# Altium schematic sheet MotionControllerV1.1_EtherCAT.SchDoc
size 889 x 508 mm
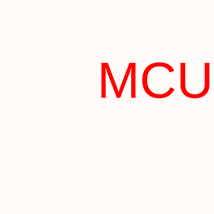
[diagram p0: MotionControllerV1.1_EtherCAT.SchDoc, top left]
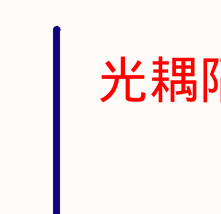
[diagram p1: MotionControllerV1.1_EtherCAT.SchDoc, top right]
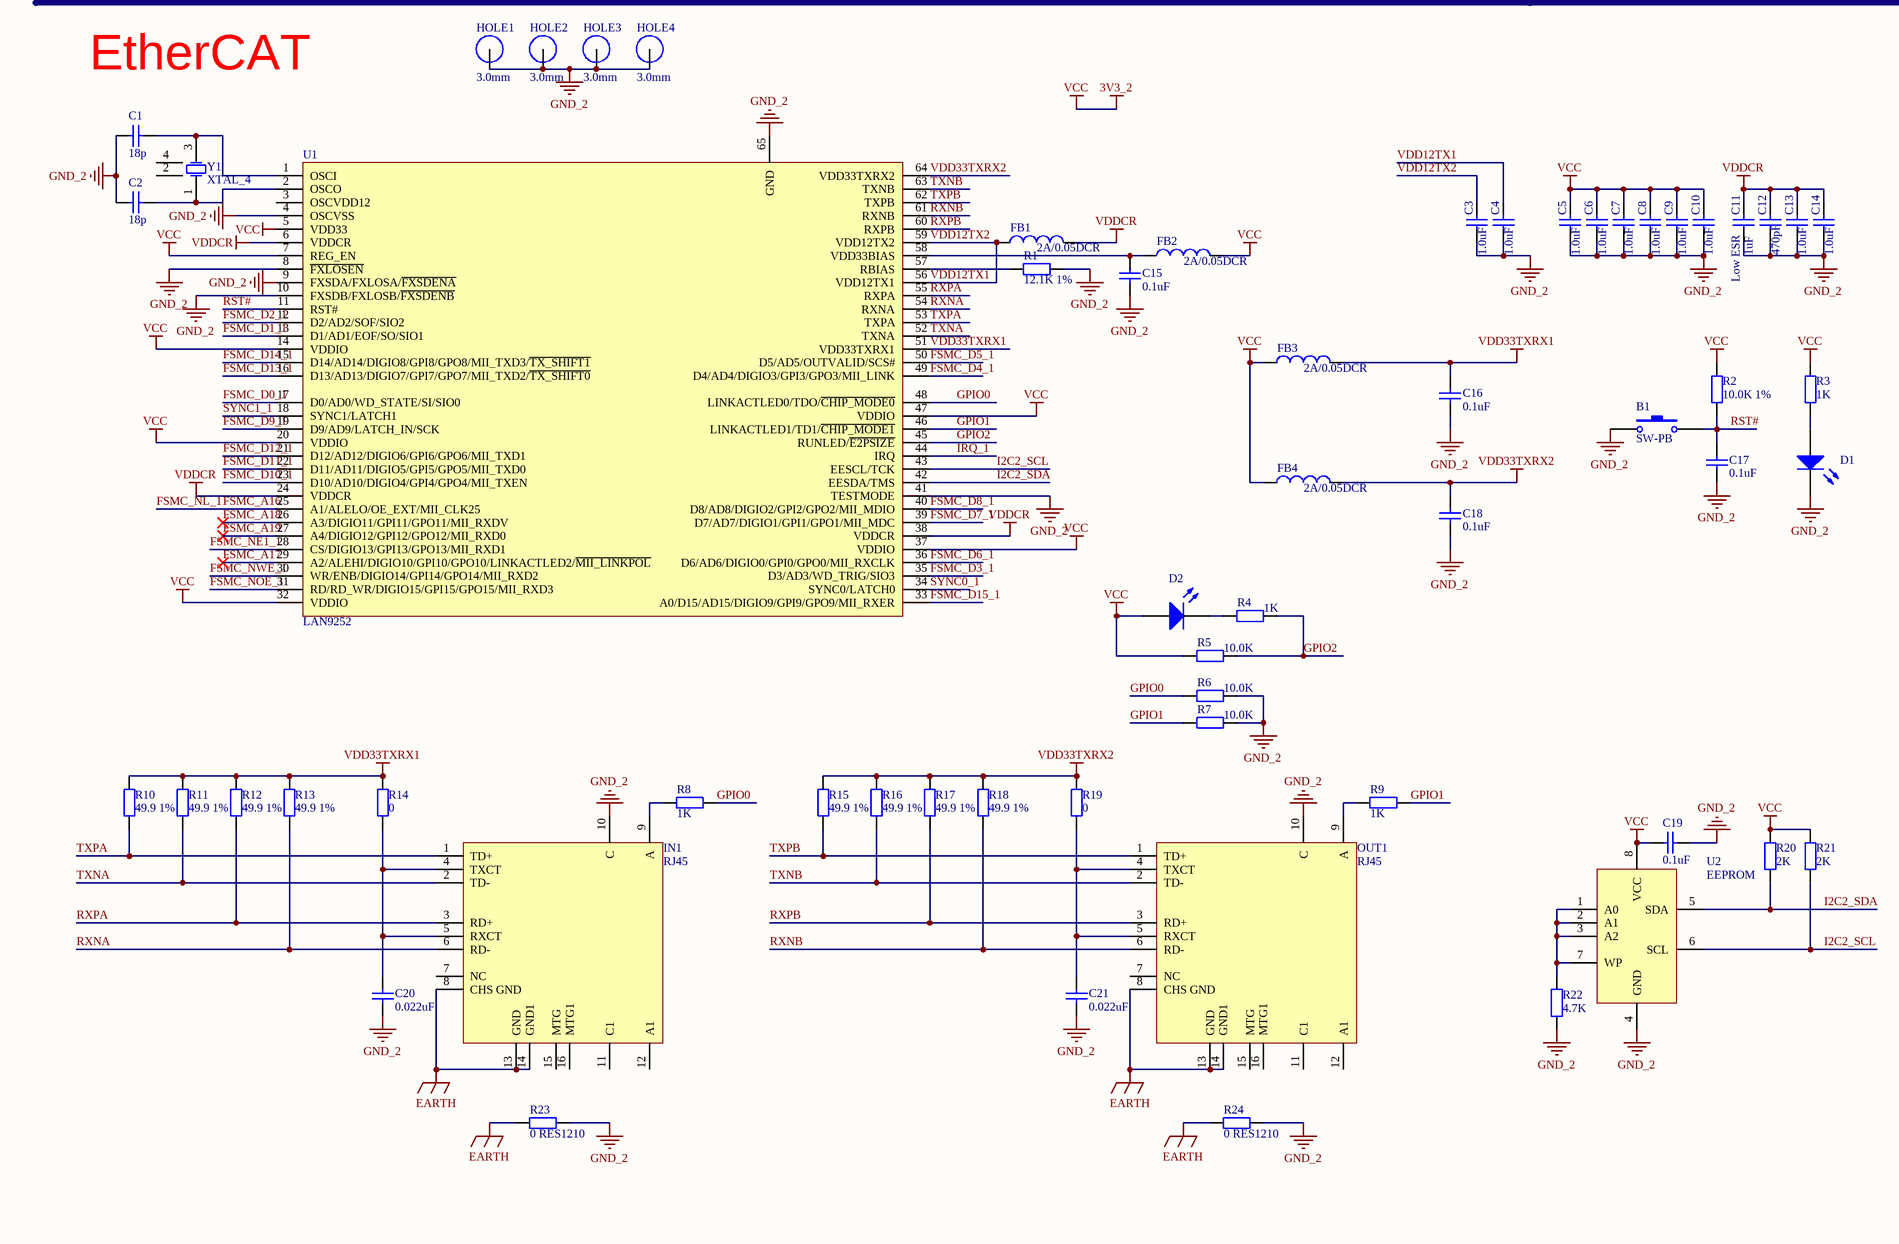
[diagram p2: MotionControllerV1.1_EtherCAT.SchDoc, bottom left]
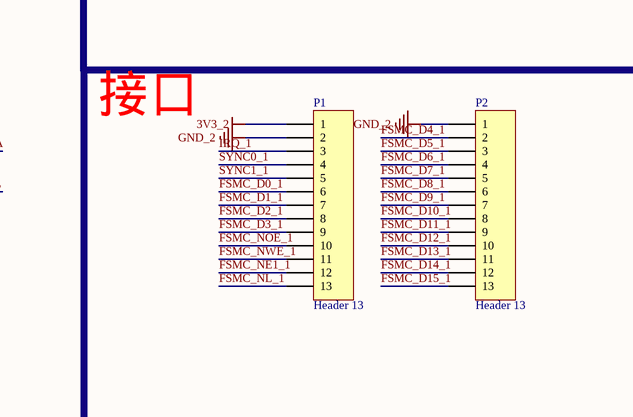
[diagram p3: MotionControllerV1.1_EtherCAT.SchDoc, bottom middle]
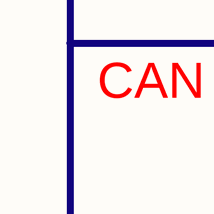
[diagram p4: MotionControllerV1.1_EtherCAT.SchDoc, bottom right]

## Parts
B1  SW-PB  [TSW SMD-3*6*2.5]
C1  value 18p  [0603_C]  (hidden comment: Cap)
C2  value 18p  [0603_C]  (hidden comment: Cap)
C3  value 1.0uF  [0603_C]  (hidden comment: Cap)
C4  value 1.0uF  [0603_C]  (hidden comment: Cap)
C5  value 1.0uF  [0603_C]  (hidden comment: Cap)
C6  value 1.0uF  [0603_C]  (hidden comment: Cap)
C7  value 1.0uF  [0603_C]  (hidden comment: Cap)
C8  value 1.0uF  [0603_C]  (hidden comment: Cap)
C9  value 1.0uF  [0603_C]  (hidden comment: Cap)
C10  value 1.0uF  [0603_C]  (hidden comment: Cap)
C11  value 1uF  [0603_C]  (hidden comment: Cap)
C12  value 470pF  [0603_C]  (hidden comment: Cap)
C13  value 1.0uF  [0603_C]  (hidden comment: Cap)
C14  value 1.0uF  [0603_C]  (hidden comment: Cap)
C15  value 0.1uF  [0603_C]  (hidden comment: Cap)
C16  value 0.1uF  [0603_C]  (hidden comment: Cap)
C17  value 0.1uF  [0603_C]  (hidden comment: Cap)
C18  value 0.1uF  [0603_C]  (hidden comment: Cap)
C19  value 0.1uF  [0603_C]  (hidden comment: Cap)
C20  value 0.022uF  [0603_C]  (hidden comment: Cap)
C21  value 0.022uF  [0603_C]  (hidden comment: Cap)
D1  LED0  [0603_LED]  (value not drawn)
D2  LED0  [0603_LED]  (value not drawn)
FB1  value 2A/0.05DCR  [FU 0805]  (hidden comment: Inductor)
FB2  value 2A/0.05DCR  [FU 0805]  (hidden comment: Inductor)
FB3  value 2A/0.05DCR  [FU 0805]  (hidden comment: Inductor)
FB4  value 2A/0.05DCR  [FU 0805]  (hidden comment: Inductor)
HOLE1  value 3.0mm  [M2.5x6+6_L]  (hidden comment: HOLE)
HOLE2  value 3.0mm  [M2.5x6+6_L]  (hidden comment: HOLE)
HOLE3  value 3.0mm  [M2.5x6+6_L]  (hidden comment: HOLE)
HOLE4  value 3.0mm  [M2.5x6+6_L]  (hidden comment: HOLE)
IN1  RJ45  [RJ-45A12]
OUT1  RJ45  [RJ-45A12]
P1  Header 13  [HDR2.54-LI-13P]
P2  Header 13  [HDR2.54-LI-13P]
R1  value 12.1K 1%  [0603_R]  (hidden comment: Res2)
R2  value 10.0K 1%  [0603_R]  (hidden comment: Res2)
R3  value 1K  [0603_R]  (hidden comment: Res2)
R4  value 1K  [0603_R]  (hidden comment: Res2)
R5  value 10.0K  [0603_R]  (hidden comment: Res2)
R6  value 10.0K  [0603_R]  (hidden comment: Res2)
R7  value 10.0K  [0603_R]  (hidden comment: Res2)
R8  value 1K  [0603_R]  (hidden comment: Res2)
R9  value 1K  [0603_R]  (hidden comment: Res2)
R10  value 49.9 1%  [0603_R]  (hidden comment: Res2)
R11  value 49.9 1%  [0603_R]  (hidden comment: Res2)
R12  value 49.9 1%  [0603_R]  (hidden comment: Res2)
R13  value 49.9 1%  [0603_R]  (hidden comment: Res2)
R14  value 0  [0603_R]  (hidden comment: Res2)
R15  value 49.9 1%  [0603_R]  (hidden comment: Res2)
R16  value 49.9 1%  [0603_R]  (hidden comment: Res2)
R17  value 49.9 1%  [0603_R]  (hidden comment: Res2)
R18  value 49.9 1%  [0603_R]  (hidden comment: Res2)
R19  value 0  [0603_R]  (hidden comment: Res2)
R20  value 2K  [0603_R]  (hidden comment: Res2)
R21  value 2K  [0603_R]  (hidden comment: Res2)
R22  value 4.7K  [0603_R]  (hidden comment: Res2)
R23  value 0 RES1210  [0603_R]  (hidden comment: Res2)
R24  value 0 RES1210  [0603_R]  (hidden comment: Res2)
U1  LAN9252  [QFN64]
U2  EEPROM  [SOP8]
Y1  XTAL_4  [OSC 3225-4P]

## Nets
3V3_2: C5.2 C6.2 C7.2 C8.2 C9.2 C10.2 C19.1 D2.1(A) FB2.2 FB3.1 FB4.1 P1.1 R2.1 R3.1 R5.2 R20.1 R21.1 U1.5(VDD33) U1.7(REG_EN) U1.14(VDDIO) U1.20(VDDIO) U1.32(VDDIO) U1.37(VDDIO) U1.47(VDDIO) U2.8(VCC)  [also labelled VCC]
EARTH: IN1.8(CHS_GND) IN1.13(GND) IN1.14(GND1) OUT1.8(CHS_GND) OUT1.13(GND) OUT1.14(GND1) R23.2 R24.2
GND_2: B1.1 C1.2 C2.2 C3.1 C4.1 C5.1 C6.1 C7.1 C8.1 C9.1 C10.1 C11.1 C12.1 C13.1 C14.1 C15.2 C16.2 C17.2 C18.2 C19.2 C20.2 C21.2 D1.2(K) HOLE1.1 HOLE2.1 HOLE3.1 HOLE4.1 IN1.10(C) OUT1.10(C) P1.2 P2.1 R1.1 R6.1 R7.1 R22.2 R23.1 R24.1 U1.4(OSCVSS) U1.8(~{FXLOSEN}) U1.9(FXSDA/FXLOSA/~{FXSDENA}) U1.10(FXSDB/FXLOSB/~{FXSDENB}) U1.41(TESTMODE) U1.65(GND) U2.4(GND)
VDD33TXRX1: C16.1 FB3.2 R10.2 R11.2 R12.2 R13.2 R14.2 U1.51(VDD33TXRX1)
VDD33TXRX2: C18.1 FB4.2 R15.2 R16.2 R17.2 R18.2 R19.2 U1.64(VDD33TXRX2)
VDDCR: C11.2 C12.2 C13.2 C14.2 FB1.2 U1.6(VDDCR) U1.24(VDDCR) U1.38(VDDCR)
FSMC_A16: P1.13 U1.25(A1/ALELO/OE_EXT/MII_CLK25)  [also labelled FSMC_NL_1]
FSMC_A17: U1.29(A2/ALEHI/DIGIO10/GPI10/GPO10/LINKACTLED2/~{MII_LINKPOL})
FSMC_A18: U1.26(A3/DIGIO11/GPI11/GPO11/MII_RXDV)
FSMC_A19: U1.27(A4/DIGIO12/GPI12/GPO12/MII_RXD0)
FSMC_D0_1: P1.6 U1.17(D0/AD0/WD_STATE/SI/SIO0)
FSMC_D1_1: P1.7 U1.13(D1/AD1/EOF/SO/SIO1)
FSMC_D2_1: P1.8 U1.12(D2/AD2/SOF/SIO2)
FSMC_D3_1: P1.9 U1.35(D3/AD3/WD_TRIG/SIO3)
FSMC_D4_1: P2.2 U1.49(D4/AD4/DIGIO3/GPI3/GPO3/MII_LINK)
FSMC_D5_1: P2.3 U1.50(D5/AD5/OUTVALID/SCS#)
FSMC_D6_1: P2.4 U1.36(D6/AD6/DIGIO0/GPI0/GPO0/MII_RXCLK)
FSMC_D7_1: P2.5 U1.39(D7/AD7/DIGIO1/GPI1/GPO1/MII_MDC)
FSMC_D8_1: P2.6 U1.40(D8/AD8/DIGIO2/GPI2/GPO2/MII_MDIO)
FSMC_D9_1: P2.7 U1.19(D9/AD9/LATCH_IN/SCK)
FSMC_D10_1: P2.8 U1.23(D10/AD10/DIGIO4/GPI4/GPO4/MII_TXEN)
FSMC_D11_1: P2.9 U1.22(D11/AD11/DIGIO5/GPI5/GPO5/MII_TXD0)
FSMC_D12_1: P2.10 U1.21(D12/AD12/DIGIO6/GPI6/GPO6/MII_TXD1)
FSMC_D13_1: P2.11 U1.16(D13/AD13/DIGIO7/GPI7/GPO7/MII_TXD2/~{TX_SHIFT0})
FSMC_D14_1: P2.12 U1.15(D14/AD14/DIGIO8/GPI8/GPO8/MII_TXD3/~{TX_SHIFT1})
FSMC_D15_1: P2.13 U1.33(A0/D15/AD15/DIGIO9/GPI9/GPO9/MII_RXER)
FSMC_NE1_1: P1.12 U1.28(CS/DIGIO13/GPI13/GPO13/MII_RXD1)
FSMC_NOE_1: P1.10 U1.31(RD/RD_WR/DIGIO15/GPI15/GPO15/MII_RXD3)
FSMC_NWE_1: P1.11 U1.30(WR/ENB/DIGIO14/GPI14/GPO14/MII_RXD2)
GPIO0: R6.2 R8.1 U1.48(LINKACTLED0/TDO/~{CHIP_MODE0})
GPIO1: R7.2 R9.1 U1.46(LINKACTLED1/TD1/~{CHIP_MODE1})
GPIO2: R4.1 R5.1 U1.45(RUNLED/~{E2PSIZE})
I2C2_SCL: R21.2 U1.43(EESCL/TCK) U2.6(SCL)
I2C2_SDA: R20.2 U1.42(EESDA/TMS) U2.5(SDA)
IRQ_1: P1.3 U1.44(IRQ)
RST#: B1.2 C17.1 R2.2 U1.11(RST#)
RXNA: IN1.6(RD-) R13.1 U1.54(RXNA)
RXNB: OUT1.6(RD-) R18.1 U1.61(RXNB)
RXPA: IN1.3(RD+) R12.1 U1.55(RXPA)
RXPB: OUT1.3(RD+) R17.1 U1.60(RXPB)
SYNC0_1: P1.4 U1.34(SYNC0/LATCH0)
SYNC1_1: P1.5 U1.18(SYNC1/LATCH1)
TXNA: IN1.2(TD-) R11.1 U1.52(TXNA)
TXNB: OUT1.2(TD-) R16.1 U1.63(TXNB)
TXPA: IN1.1(TD+) R10.1 U1.53(TXPA)
TXPB: OUT1.1(TD+) R15.1 U1.62(TXPB)
VDD12TX1: C3.2 C4.2 FB1.1 U1.56(VDD12TX1) U1.59(VDD12TX2)  [also labelled VDD12TX2]
NetC1_1: C1.1 U1.1(OSCI) Y1.3(OSC2)
NetC2_1: C2.1 U1.2(OSCO) Y1.1(OSC1)
NetC15_1: C15.1 FB2.1 U1.58(VDD33BIAS)
NetC20_1: C20.1 IN1.4(TXCT) IN1.5(RXCT) R14.1
NetC21_1: C21.1 OUT1.4(TXCT) OUT1.5(RXCT) R19.1
NetD1_1: D1.1(A) R3.2
NetD2_2: D2.2(K) R4.2
NetIN1_9: IN1.9(A) R8.2
NetOUT1_9: OUT1.9(A) R9.2
NetR1_2: R1.2 U1.57(RBIAS)
NetR22_1: R22.1 U2.1(A0) U2.2(A1) U2.3(A2) U2.7(WP)

Not connected (* = marked no-connect by the designer): IN1 7(NC) 11(C1) 12(A1) 15(MTG) 16(MTG1); OUT1 7(NC) 11(C1) 12(A1) 15(MTG) 16(MTG1); U1 3(OSCVDD12); Y1 2(OSC2) 4(OSC2)

## Notes on the sheet
- MCU
- 光耦隔离
- EtherCAT
- (near C11) Low ESR
- CAN
- 接口

## Library data of the parts
B1 = SW-PB: Switch; Published: 24-Mar-1999; LatestRevisionDate: 17-Jul-2002; LatestRevisionNote: Re-released for DXP Platform.; PackageReference: SPST-2; Publisher: Altium Limited; PackageDescription: Switch; 2 Leads
C1-C21 = Cap: Capacitor; Published: 8-Jun-2000; LatestRevisionDate: 17-Jul-2002; LatestRevisionNote: Re-released for DXP Platform.; PackageReference: RAD-0.3; Publisher: Altium Limited; PackageDescription: Radial Cap, Thru-Hole; 2 Leads; 0.3 in Pin Spacing
D1 D2 = LED0: Typical INFRARED GaAs LED; Published: 8-Jun-2000; LatestRevisionDate: 08-Jul-2005; LatestRevisionNote: Mech Layer 1 removed.; PackageReference: LED-0; Publisher: Altium Limited; PackageDescription: LED; 2 Leads
FB1-FB4 = Inductor: Code_IEC: 1005; Published: 8-Jun-2000; LatestRevisionDate: 29-May-2009; LatestRevisionNote: IPC-7351 Footprint Added.; PackageReference: 0402-A; Publisher: Altium Limited; PackageDescription: Chip Inductor; Code_JEITA: 0402
P1 P2 = Header 13: Header, 13-Pin; LatestRevisionDate: 17-Jul-2002; LatestRevisionNote: Re-released for DXP Platform.; Publisher: Altium Limited
R1-R24 = Res2: Resistor; Published: 8-Jun-2000; LatestRevisionDate: 17-Jul-2002; LatestRevisionNote: Re-released for DXP Platform.; PackageReference: AXIAL-0.4; Publisher: Altium Limited; PackageDescription: Axial Device, Thru-Hole; 2 Leads; 0.4 in Pin Spacing
Y1 = XTAL_4: Crystal Oscillator; Published: 8-Jun-2000; LatestRevisionDate: 17-Jul-2002; LatestRevisionNote: Re-released for DXP Platform.; PackageReference: R38; Publisher: Altium Limited; PackageDescription: Crystal, Thru-Hole; 2 Leads; Body 3.1 x 8.2 mm (Dia.xH)